# EAGLE design 2x2Button_Pad_Breakout-v01 (EAGLE 5.06)
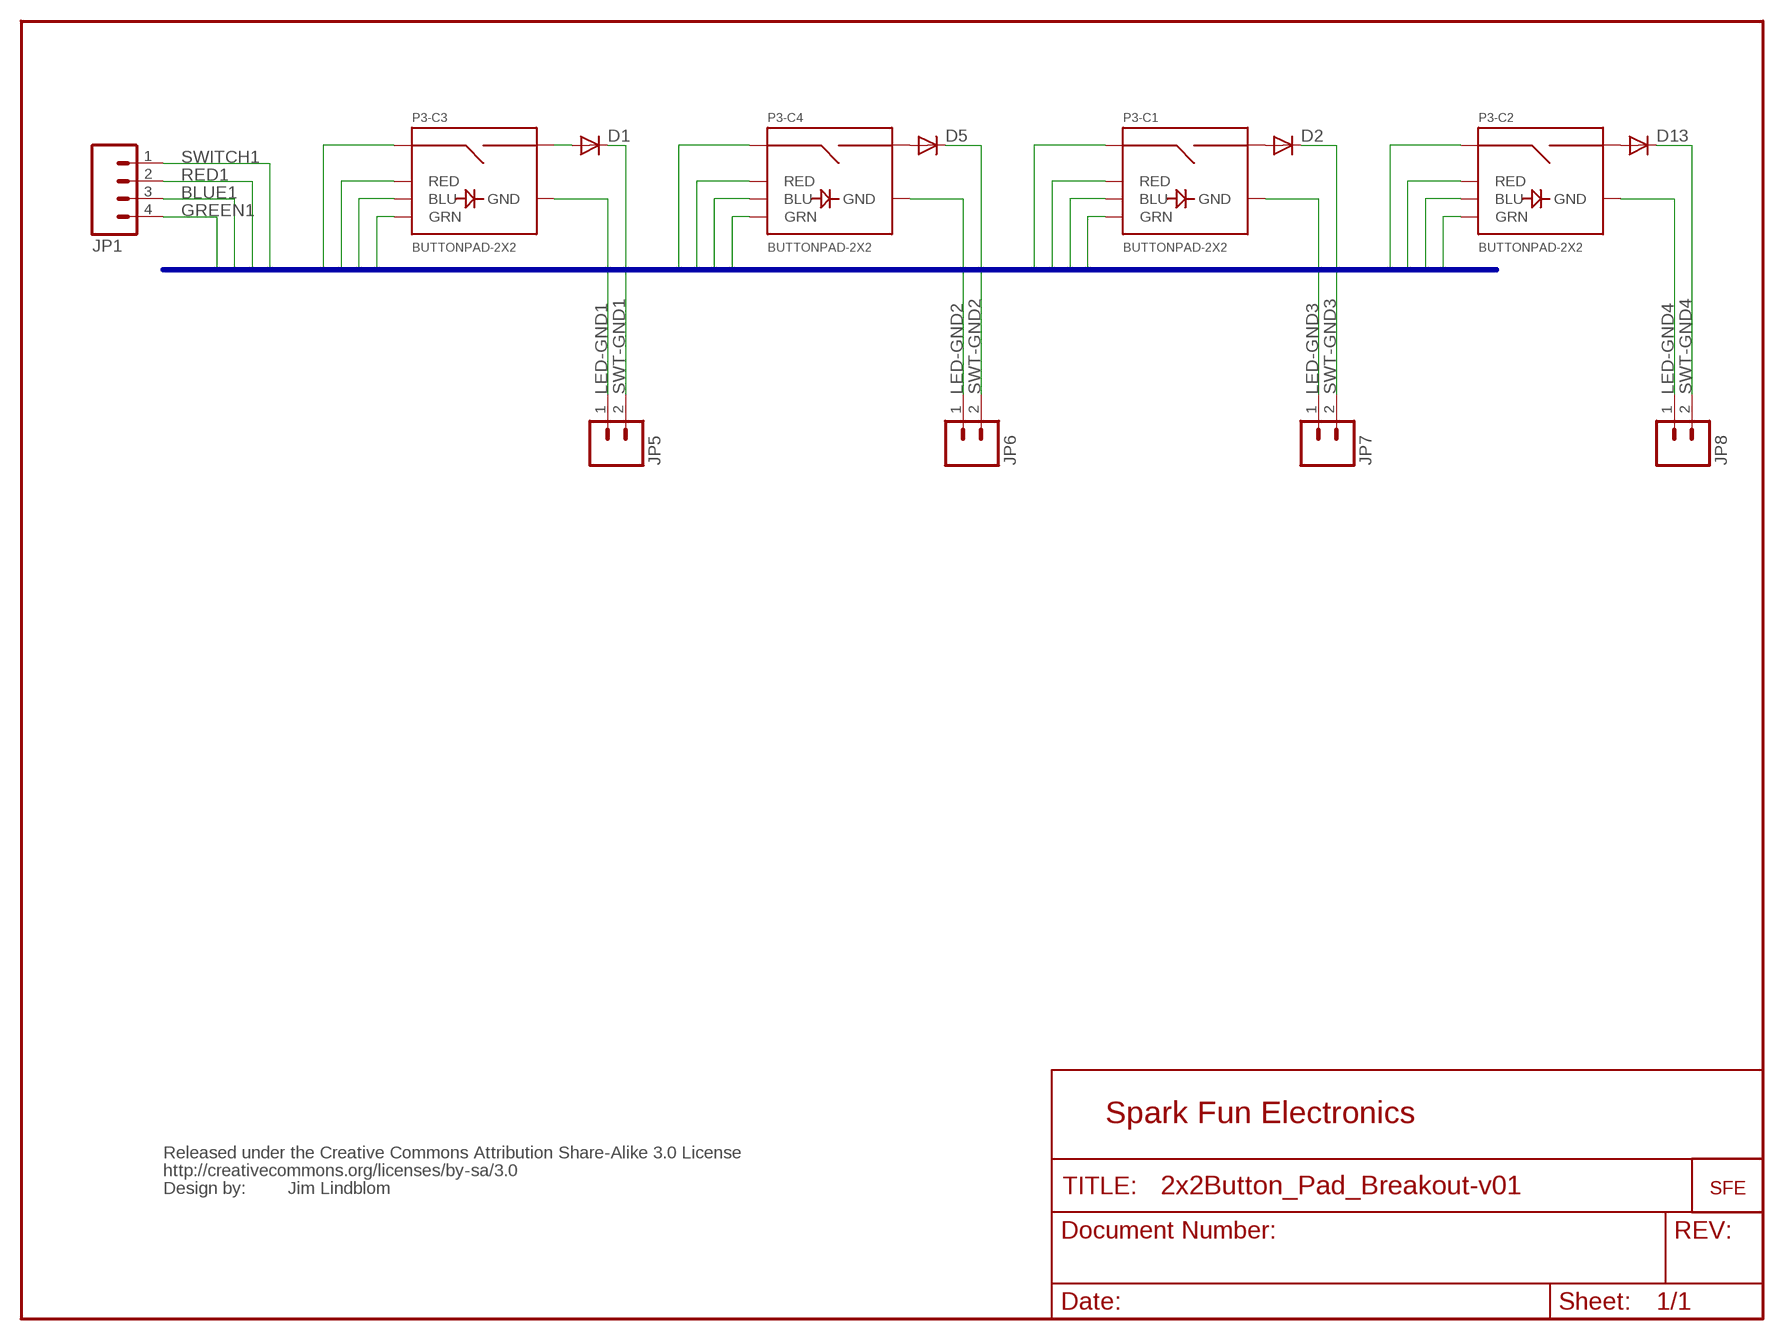
[diagram p0: schematic, sheet 1]

## Parts
D1  DIODE-1N4148  [DOIDE-1N4148]
D2  DIODE-1N4148  [DOIDE-1N4148]
D5  DIODE-1N4148  [DOIDE-1N4148]
D13  DIODE-1N4148  [DOIDE-1N4148]
JP1  M04POLAR  [MOLEX-1X4]
JP5  M02POLAR  [MOLEX-1X2]
JP6  M02POLAR  [MOLEX-1X2]
JP7  M02POLAR  [MOLEX-1X2]
JP8  M02POLAR  [MOLEX-1X2]
P3  BUTTONPAD-2X2  [BUTTONPAD-2X2]
U$1  LOGO-SFENEW  [SFE-NEW-WEBLOGO]
U$2  CREATIVE_COMMONS  [CREATIVE_COMMONS]

## Nets
BLUE1 [LEDPower]: JP1.3 P3.BLU1(-C1:BLU) P3.BLU2(-C2:BLU) P3.BLU3(-C3:BLU) P3.BLU4(-C4:BLU)
GREEN1 [LEDPower]: JP1.4 P3.GRN1(-C1:GRN) P3.GRN2(-C2:GRN) P3.GRN3(-C3:GRN) P3.GRN4(-C4:GRN)
LED-GND1 [LEDPower]: JP5.1 P3.GND3(-C3:GND)
LED-GND2 [LEDPower]: JP6.1 P3.GND4(-C4:GND)
LED-GND3 [LEDPower]: JP7.1 P3.GND1(-C1:GND)
LED-GND4 [LEDPower]: JP8.1 P3.GND2(-C2:GND)
N$1: D1.P$1(A) P3.SIG6(-C3:SIG2)
N$2: D2.P$1(A) P3.SIG2(-C1:SIG2)
N$3: D13.P$1(A) P3.SIG4(-C2:SIG2)
N$5: D5.P$1(A) P3.SIG8(-C4:SIG2)
RED1 [LEDPower]: JP1.2 P3.RED1(-C1:RED) P3.RED2(-C2:RED) P3.RED3(-C3:RED) P3.RED4(-C4:RED)
SWITCH1 [ButtonSignal]: JP1.1 P3.SIG1(-C1:SIG1) P3.SIG3(-C2:SIG1) P3.SIG5(-C3:SIG1) P3.SIG7(-C4:SIG1)
SWT-GND1 [ButtonSignal]: D1.P$2(C) JP5.2
SWT-GND2 [ButtonSignal]: D5.P$2(C) JP6.2
SWT-GND3 [ButtonSignal]: D2.P$2(C) JP7.2
SWT-GND4 [ButtonSignal]: D13.P$2(C) JP8.2

## Buses
BUS1:RED1,BLUE1,GREEN1,SWITCH1

## Notes on the sheet
- Spark Fun Electronics
- Jim Lindblom

## Library data of the parts
D1 D2 D5 D13 = SparkFun:DIODE-1N4148
JP1 = SparkFun:M04: Header 4 Standard 4-pin 0.1" header. Use with straight break away headers (SKU : PRT-00116), right angle break away headers (PRT-00553), swiss pins (PRT-00743), machine pins (PRT-00117), and female headers (PRT-00115). Molex polarized connector foot print use with SKU : PRT-08231 with associated crimp pins and housings.
JP5-JP8 = SparkFun:M02: Header 2 Standard 2-pin 0.1" header. Use with straight break away headers (SKU : PRT-00116), right angle break away headers (PRT-00553), swiss pins (PRT-00743), machine pins (PRT-00117), and female headers (PRT-00115). Molex polarized connector foot print use with SKU : PRT-08233 with associated crimp pins and housings.
P3 = SparkFun:BUTTONPAD-2X2: 5mm Button Pad Proven layout and schematic for 2x2 button pad. Panelize this device/fp to a 4x4 pad if needed. Spark Fun Electronics SKU : COM-07835. Compatible common cathode tri-color LED SKU : COM-00105
U$1 = SparkFun:LOGO-SFE: Spark Fun Electronics PCB Logo This is the standard Spark Fun Electronics PCB logo.
U$2 = SparkFun:CREATIVE_COMMONS

## Net classes
0 Default: width 0.254 mm
1 Power: width 0.305 mm
2 LEDPower: width 0.305 mm
3 ButtonSignal: width 0.254 mm

## Board
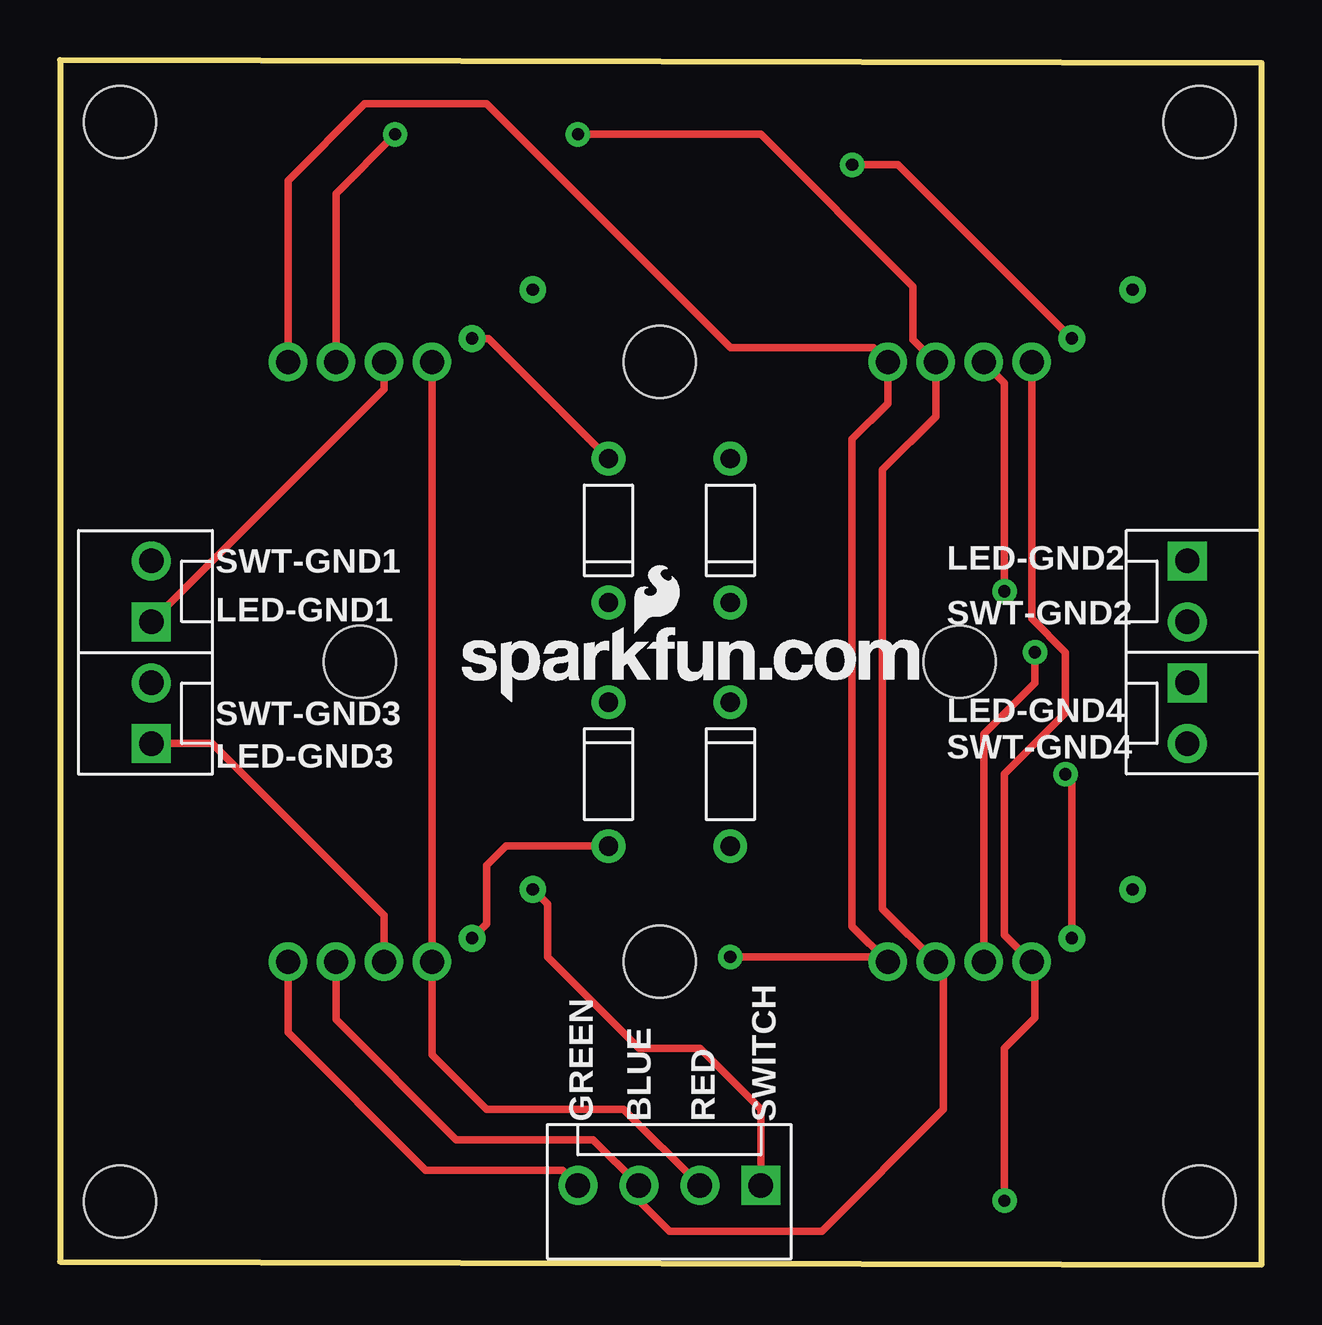
[diagram p1: board, top side]
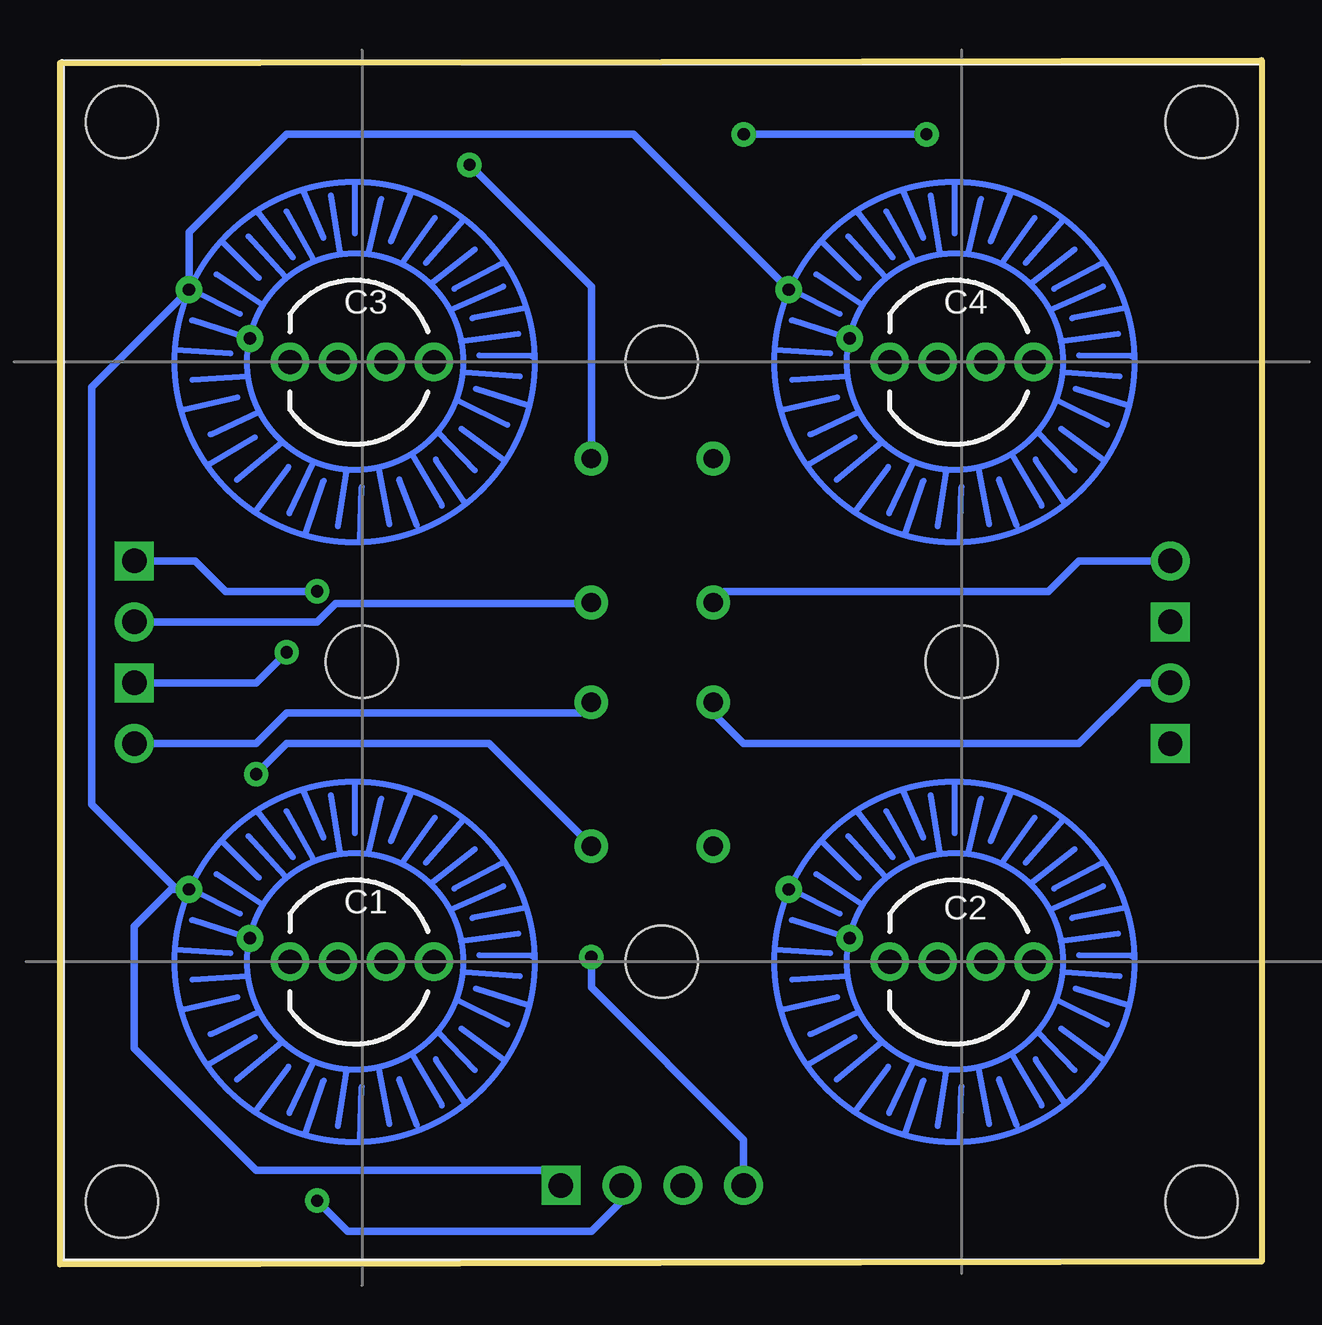
[diagram p2: board, bottom side, seen from below]

Size 50.09 x 50.22 mm. Coordinates in mm from the lower left corner, seen from the top.
Outline: 0,0.13 50.09,0 50.09,50.09 0,50.22 0,0.13
Copper layers (1*16): Top 0.035mm / dielectric 1.5mm / Bottom 0.035mm
Design rules "SparkFun": minimum track width 8mil, minimum drill 20mil, track to track 8mil, track to pad 8mil, pad to pad 8mil, via to via 8mil, smd to smd 8mil, copper to edge 10mil, drill to drill 8mil, minimum pad ring 12mil, minimum via ring 10mil, stop-mask expansion 4mil, vias tented up to drill 25mil, thermal gap 10mil

### Footprints (pad centres in the part's own frame; a part is rotated, then mirrored left to right if it is on the bottom)
DOIDE-1N4148 = drill 0.8 round: P$1 3,0; P$2 -3,0
MOLEX-1X4 = drill 1.016 square: 1 0,0 | drill 1.016 round: 2 2.54,0; 3 5.08,0; 4 7.62,0
MOLEX-1X2 = drill 1.016 square: 1 0,0 | drill 1.016 round: 2 2.54,0
BUTTONPAD-2X2 = drill 1 round: BLU1 13.5,12.5; BLU2 38.5,12.5; BLU3 13.5,37.5; BLU4 38.5,37.5; GND1 11.5,12.5; GND2 36.5,12.5; GND3 11.5,37.5; GND4 36.5,37.5; GRN1 15.5,12.5; GRN2 40.5,12.5; GRN3 15.5,37.5; GRN4 40.5,37.5; RED1 9.5,12.5; RED2 34.5,12.5; RED3 9.5,37.5; RED4 34.5,37.5 | drill 0.508 round: SIG1 5.288,15.513; SIG2 7.828,13.481; SIG3 30.288,15.513; SIG4 32.828,13.481; SIG5 5.288,40.513; SIG6 7.828,38.481; SIG7 30.288,40.513; SIG8 32.828,38.481 | hole 3: 12.5,25; 25,37.5; 37.5,25; 25,12.5; 2.5,2.5; 2.5,47.5; 47.5,47.5; 47.5,2.5

### Placement (x,y rotation side)
D1  27.94,30.61 90 top
D2  27.94,20.45 270 top
D5  22.86,30.61 90 top
D13  22.86,20.45 270 top
JP1  29.21,3.3 180 top
JP5  46.99,29.34 270 top
JP6  3.81,26.8 90 top
JP7  46.99,24.26 270 top
JP8  3.81,21.72 90 top
P3  50,0.13 0 bottom
U$1  16.75,23.45 0 top
U$2  15.24,-18.92 0 top  (outside the outline)

### Tracks (layer width: path | path; a pad name or v marks a point on that pad's centre or on a via)
BLUE1  (via drill 0.51)
  Top 0.305: P3.BLU2 11.5,10.22 16.51,5.21 22.23,5.21 JP1.3 24.13,2.67 25.4,1.4 31.75,1.4 36.83,6.48 36.83,12.3 P3.BLU1 34.29,14.84 34.29,33.15 36.5,35.36 P3.BLU3 35.56,38.57 35.56,40.77 29.21,47.12 v21.59,47.12 | P3.BLU4 11.5,44.65 v13.97,47.12
  Bottom 0.305: v13.97,47.12 v21.59,47.12
GREEN1  (via drill 0.51)
  Top 0.305: P3.GRN2 9.5,9.68 15.24,3.94 20.95,3.94 JP1.4 | v27.94,12.83 34.3,12.83 P3.GRN1 33.02,14.11 33.02,34.42 34.5,35.9 P3.GRN3 33.9,38.23 27.94,38.23 17.78,48.39 12.7,48.39 9.5,45.19 P3.GRN4
  Bottom 0.305: v27.94,12.83 27.94,11.56 21.59,5.21 JP1.4
LED-GND1  (via drill 0.51)
  Top 0.305: v39.37,28.07 39.37,36.76 P3.GND3
  Bottom 0.305: v39.37,28.07 43.18,28.07 44.45,29.34 JP5.1
LED-GND2
  Top 0.305: P3.GND4 13.5,36.49 JP6.1
LED-GND3  (via drill 0.51)
  Top 0.305: P3.GND1 38.5,22.12 40.64,24.26 v40.64,25.53
  Bottom 0.305: JP7.1 41.91,24.26 v40.64,25.53
LED-GND4
  Top 0.305: P3.GND2 13.5,14.57 6.35,21.72 JP8.1
N$1  (via drill 0.51)
  Top 0.305: v33.02,45.85 34.93,45.85 P3.SIG6
  Bottom 0.305: D1.P$1 27.94,40.77 v33.02,45.85
N$2  (via drill 0.51)
  Top 0.305: P3.SIG2 42.17,20.18 v41.91,20.45
  Bottom 0.305: v41.91,20.45 40.64,21.72 32.21,21.72 D2.P$1
N$3
  Top 0.305: D13.P$1 18.59,17.45 17.78,16.64 17.78,14.22 P3.SIG4
N$5
  Top 0.305: P3.SIG8 17.86,38.61 D5.P$1
RED1  (via drill 0.51)
  Top 0.305: JP1.2 23.5,6.48 17.78,6.48 15.5,8.76 P3.RED2 P3.RED4 | v39.37,2.67 39.37,9.02 40.64,10.29 40.64,12.49 P3.RED1 39.37,13.76 39.37,20.45 41.91,22.99 41.91,25.53 40.5,26.94 P3.RED3
  Bottom 0.305: JP1.2 26.67,2.67 27.94,1.4 38.1,1.4 v39.37,2.67
SWITCH1
  Top 0.305: JP1.1 29.21,6.48 26.67,9.02 24.13,9.02 20.32,12.83 20.32,15.03 P3.SIG3
  Bottom 0.305: JP1.1 29.84,3.94 41.91,3.94 46.99,9.02 46.99,14.1 45.45,15.64 P3.SIG1 45.23,15.64 48.77,19.18 48.77,36.58 P3.SIG5 44.71,43.05 40.64,47.12 26.19,47.12 P3.SIG7
SWT-GND1
  Bottom 0.305: JP5.2 39.37,26.8 38.61,27.56 27.99,27.56 D1.P$2
SWT-GND2
  Bottom 0.305: JP6.2 7.62,29.34 8.89,28.07 22.4,28.07 D5.P$2
SWT-GND3
  Bottom 0.305: JP7.2 41.91,21.72 40.64,22.99 28.4,22.99 D2.P$2
SWT-GND4
  Bottom 0.305: D13.P$2 22.86,22.99 21.59,21.72 7.62,21.72 5.08,24.26 JP8.2

### Text on the board
tPlace: SWT-GND1 | LED-GND2 | LED-GND1 | SWT-GND2 | SWT-GND3 | LED-GND4 | LED-GND3 | SWT-GND4 | GREEN | BLUE | RED | SWITCH
Document: N. Seidle